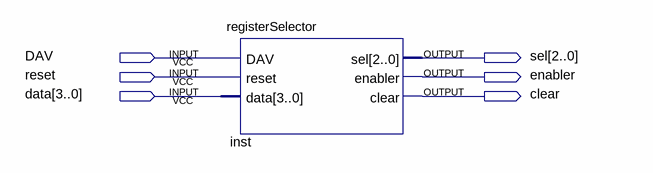
[diagram p0: schematic sheet]
// Quartus schematic testRegisterSelector.bdf as structural Verilog: 1 symbols, 6 pins
module testRegisterSelector (
  input  DAV,
  input  reset,
  input  [3:0] data,
  output [2:0] sel,
  output enabler,
  output clear
);

  registerSelector inst (.DAV(DAV), .reset(reset), .data(data), .sel(sel), .enabler(enabler), .clear(clear));
endmodule
